# EAGLE design strobe_tuner (EAGLE 7.4.0)
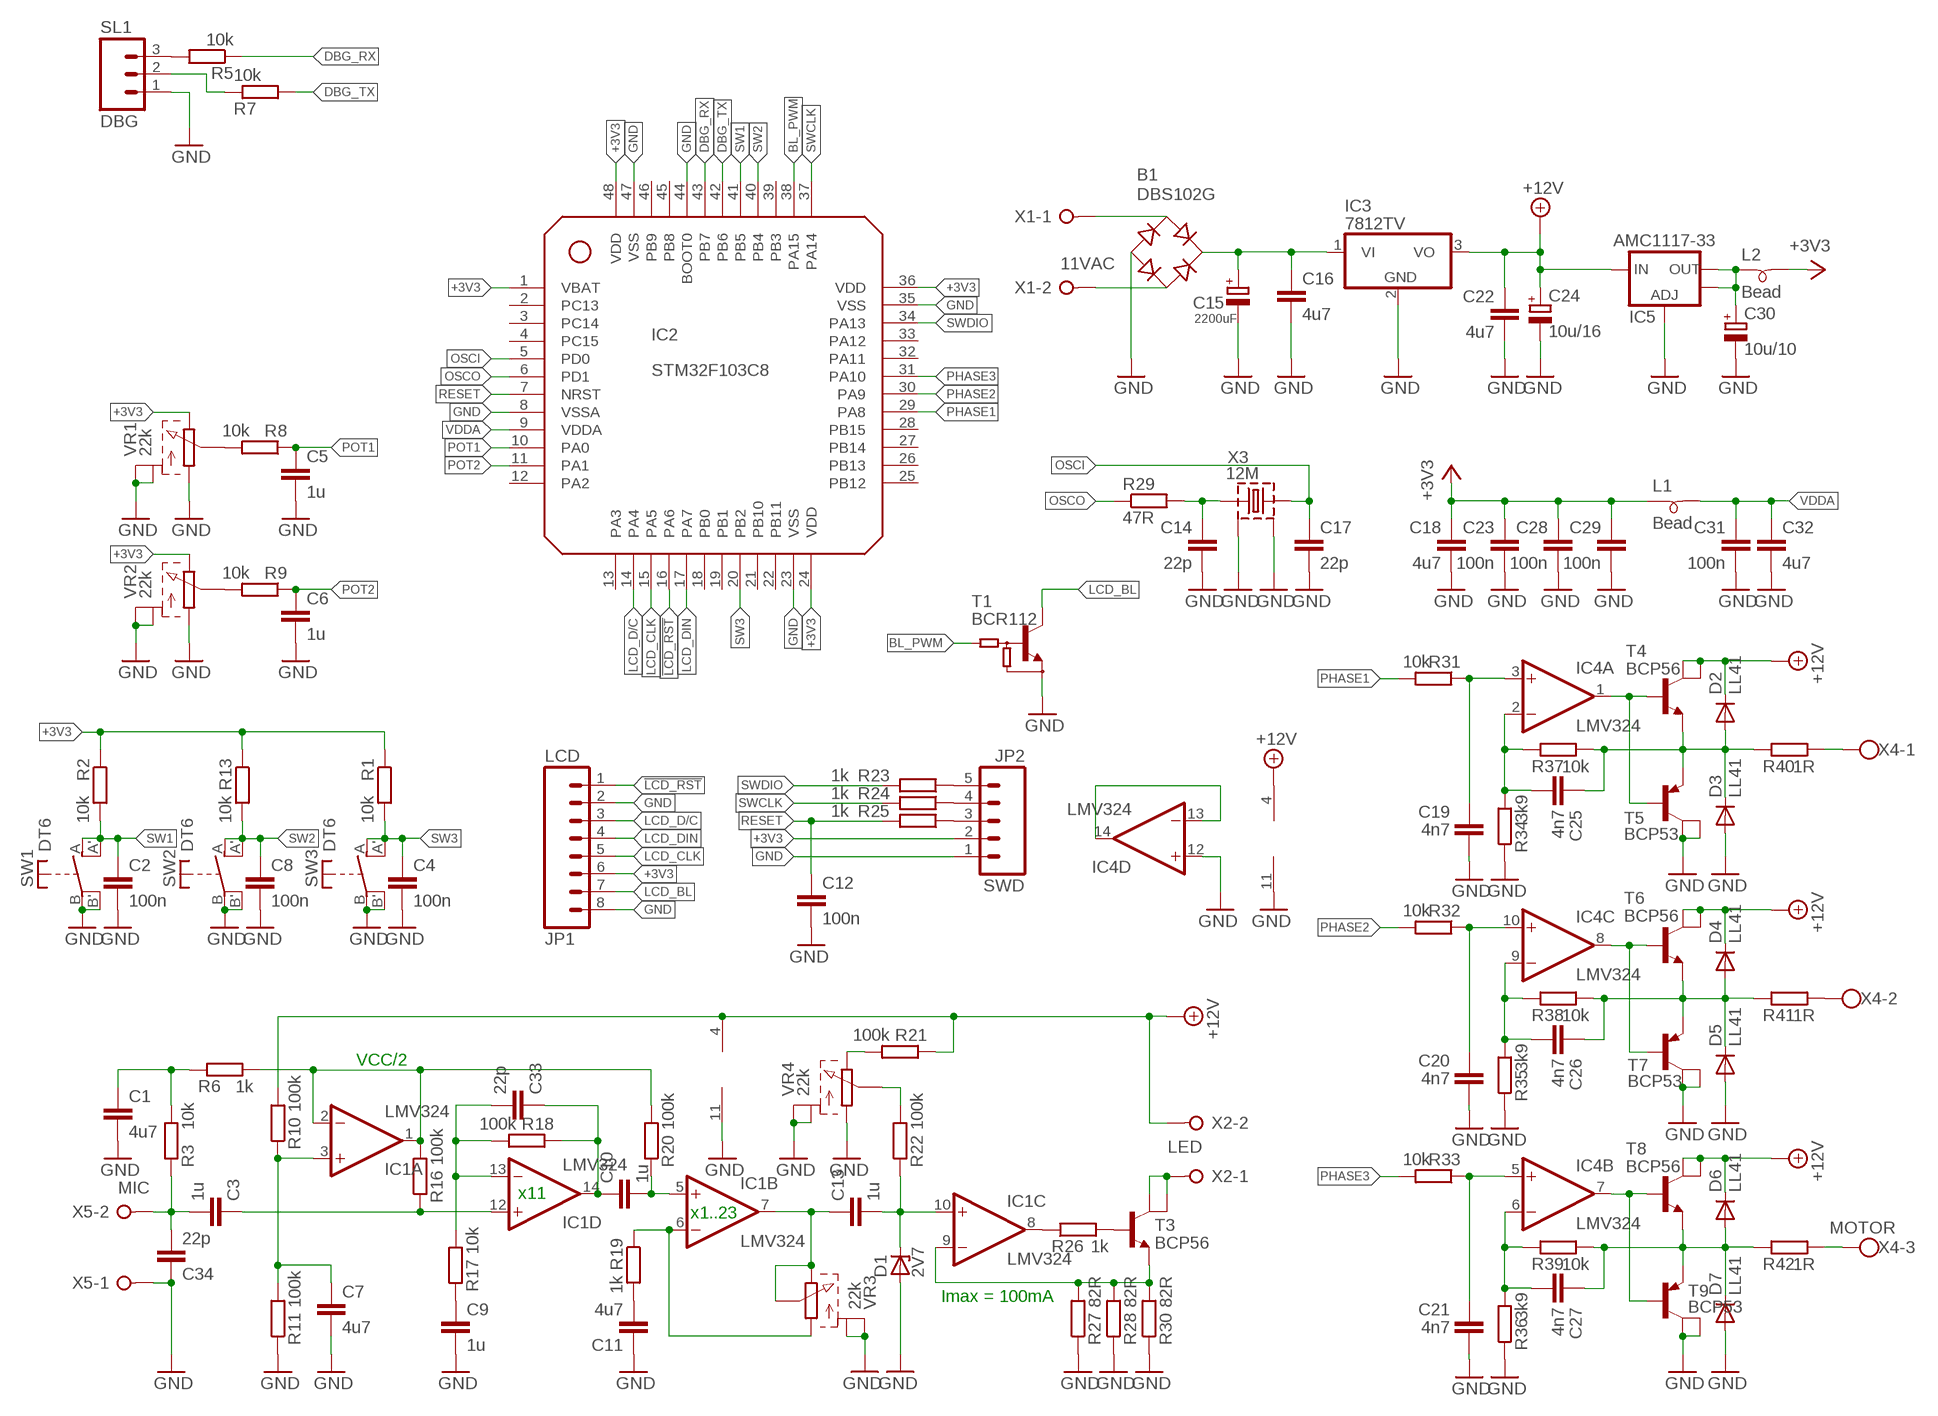
[diagram p0: schematic, sheet 1]

## Parts
B1  DBS102G  [DBS]
C1  4u7  1206_CAP  [1206]
C2  100n  0805_CAP  [0805]
C3  1u  1206_CAP  [1206]
C4  100n  0805_CAP  [0805]
C5  1u  1206_CAP  [1206]
C6  1u  1206_CAP  [1206]
C7  4u7  1206_CAP  [1206]
C8  100n  0805_CAP  [0805]
C9  1u  1206_CAP  [1206]
C10  1u  1206_CAP  [1206]
C11  4u7  1206_CAP  [1206]
C12  100n  0805_CAP  [0805]
C13  1u  1206_CAP  [1206]
C14  22p  0805_CAP  [0805]
C15  2200uF  CPOL-EUE5-13  [E5-13]
C16  4u7  1206_CAP  [1206]
C17  22p  0805_CAP  [0805]
C18  4u7  1206_CAP  [1206]
C19  4n7  0805_CAP  [0805]
C20  4n7  0805_CAP  [0805]
C21  4n7  0805_CAP  [0805]
C22  4u7  1206_CAP  [1206]
C23  100n  0805_CAP  [0805]
C24  10u/16  CPOL-EUB/3528-21W  [B/3528-21W]
C25  4n7  0805_CAP  [0805]
C26  4n7  0805_CAP  [0805]
C27  4n7  0805_CAP  [0805]
C28  100n  0805_CAP  [0805]
C29  100n  0805_CAP  [0805]
C30  10u/10  CPOL-EUA/3216-18R  [A/3216-18R]
C31  100n  0805_CAP  [0805]
C32  4u7  1206_CAP  [1206]
C33  22p  0805_CAP  [0805]
C34  22p  0805_CAP  [0805]
D1  2V7  ZENER-DIODESOT23  [SOT23]
D2  LL41  PMLL41SOD80C  [SOD80C]
D3  LL41  PMLL41SOD80C  [SOD80C]
D4  LL41  PMLL41SOD80C  [SOD80C]
D5  LL41  PMLL41SOD80C  [SOD80C]
D6  LL41  PMLL41SOD80C  [SOD80C]
D7  LL41  PMLL41SOD80C  [SOD80C]
IC1  LMV324  OPA4134UA  [SO14]
IC2  STM32F103C8  [LQFP48]
IC3  7812TV  [TO220V]
IC4  LMV324  OPA4134UA  [SO14]
IC5  AMC1117-33  V_REG_LM1117SOT223  [SOT223]
JP1  LCD  M08  [1X08]
JP2  SWD  M05LOCK_LONGPADS  [1X05_LOCK_LONGPADS]
L1  Bead  0805_IND  [0805]
L2  Bead  0805_IND  [0805]
R1  10k  0805_RES  [0805]
R2  10k  0805_RES  [0805]
R3  10k  0805_RES  [0805]
R5  10k  0805_RES  [0805]
R6  1k  0805_RES  [0805]
R7  10k  0805_RES  [0805]
R8  10k  0805_RES  [0805]
R9  10k  0805_RES  [0805]
R10  100k  0805_RES  [0805]
R11  100k  0805_RES  [0805]
R13  10k  0805_RES  [0805]
R16  100k  0805_RES  [0805]
R17  10k  0805_RES  [0805]
R18  100k  0805_RES  [0805]
R19  1k  0805_RES  [0805]
R20  100k  0805_RES  [0805]
R21  100k  0805_RES  [0805]
R22  100k  0805_RES  [0805]
R23  1k  0805_RES  [0805]
R24  1k  0805_RES  [0805]
R25  1k  0805_RES  [0805]
R26  1k  0805_RES  [0805]
R27  82R  0805_RES  [0805]
R28  82R  0805_RES  [0805]
R29  47R  0805_RES  [0805]
R30  82R  0805_RES  [0805]
R31  10k  0805_RES  [0805]
R32  10k  0805_RES  [0805]
R33  10k  0805_RES  [0805]
R34  3k9  0805_RES  [0805]
R35  3k9  0805_RES  [0805]
R36  3k9  0805_RES  [0805]
R37  10k  0805_RES  [0805]
R38  10k  0805_RES  [0805]
R39  10k  0805_RES  [0805]
R40  1R  0805_RES  [0805]
R41  1R  0805_RES  [0805]
R42  1R  0805_RES  [0805]
SL1  DBG  M03  [03P]
SW1  DT6  TACTSW_DT6  [D6R]
SW2  DT6  TACTSW_DT6  [D6R]
SW3  DT6  TACTSW_DT6  [D6R]
T1  BCR112  [SOT23]
T3  BCP56  [SOT223]
T4  BCP56  [SOT223]
T5  BCP53  [SOT223]
T6  BCP56  [SOT223]
T7  BCP53  [SOT223]
T8  BCP56  [SOT223]
T9  BCP53  [SOT223]
VR1  22k  R122KNP  [R122KNP]
VR2  22k  R122KNP  [R122KNP]
VR3  22k  R122KNP  [R122KNP]
VR4  22k  R122KNP  [R122KNP]
X1  11VAC  W237-02P  [W237-132]
X2  LED  W237-02P  [W237-132]
X3  12M  CPFX-104  [CPFX-104]
X4  MOTOR  W237-103  [W237-103]
X5  MIC  W237-02P  [W237-132]

## Nets
!LCD_RST: IC2.16(PA6) JP1.1
+3V3: C18.1 C23.1 C28.1 C29.1 IC2.1(VBAT) IC2.24(VDD) IC2.36(VDD) IC2.48(VDD) JP1.6 JP2.2 L1.2 L2.1 R1.1 R2.1 R13.1 VR1.CW(E) VR2.CW(E)
+12V: C22.1 C24.+ D2.C D4.C D6.C IC1.4(P:V+) IC3.3(VO) IC4.4(P:V+) IC5.3(IN) R10.2 R21.1 T4.2(C) T4.4(C1) T6.2(C) T6.4(C1) T8.2(C) T8.4(C1) X2.2
BL_PWM: IC2.38(PA15) T1.1(B)
DBG_RX: IC2.43(PB7) R5.1
DBG_TX: IC2.42(PB6) R7.2
GND: B1.- C1.2 C2.2 C4.2 C5.2 C6.2 C7.2 C8.2 C9.2 C11.1 C12.2 C14.2 C15.- C16.2 C17.2 C18.2 C19.2 C20.2 C21.2 C22.2 C23.2 C24.- C28.2 C29.2 C30.- C31.2 C32.2 C34.1 D1.1(A) D3.A D5.A D7.A IC1.11(P:V-) IC2.8(VSSA) IC2.23(VSS) IC2.35(VSS) IC2.44(BOOT0) IC2.47(VSS) IC3.2(GND) IC4.11(P:V-) IC4.12(D:+IN) IC5.1(ADJ) JP1.2 JP1.8 JP2.1 R11.1 R27.1 R28.1 R30.1 R34.1 R35.1 R36.1 SL1.1 SW1.B'(B2) SW1.B(B1) SW2.B'(B2) SW2.B(B1) SW3.B'(B2) SW3.B(B1) T1.2(E) T5.2(C) T5.4(C1) T7.2(C) T7.4(C1) T9.2(C) T9.4(C1) VR1.CCW(A) VR1.P$1(CASE1) VR1.P$2(CASE2) VR2.CCW(A) VR2.P$1(CASE1) VR2.P$2(CASE2) VR3.P$1(CASE1) VR3.P$2(CASE2) VR4.CCW(A) VR4.P$1(CASE1) VR4.P$2(CASE2) X3.2(G1) X3.4(G2) X5.1
LCD_BL: JP1.7 T1.3(C)
LCD_CLK: IC2.15(PA5) JP1.5
LCD_D/C: IC2.14(PA4) JP1.3
LCD_DIN: IC2.17(PA7) JP1.4
N$1: C19.1 IC4.3(A:+IN) R31.1
N$2: C20.1 IC4.10(C:+IN) R32.1
N$3: C21.1 IC4.5(B:+IN) R33.1
N$4: C27.1 D6.A D7.C R39.2 R42.1 T8.3(E) T9.3(E)
N$5: C1.1 R3.2 R6.1
N$6: C7.1 IC1.3(A:+IN) R10.1 R11.2
N$7: C3.2 C34.2 R3.1 X5.2
N$8: C11.2 R19.2
N$9: R26.2 T3.1(B)
N$10: C9.1 R17.1
N$11: IC4.1(A:OUT) T4.1(B) T5.1(B)
N$12: C25.2 IC4.2(A:-IN) R34.2 R37.1
N$13: C26.1 D4.A D5.C R38.2 R41.1 T6.3(E) T7.3(E)
N$14: IC4.8(C:OUT) T6.1(B) T7.1(B)
N$15: C26.2 IC4.9(C:-IN) R35.2 R38.1
N$16: C33.2 IC1.13(D:-IN) R17.2 R18.2
N$17: IC4.7(B:OUT) T8.1(B) T9.1(B)
N$18: C27.2 IC4.6(B:-IN) R36.2 R39.1
N$19: IC1.9(C:-IN) R27.2 R28.2 R30.2 T3.3(E)
N$20: T3.2(C) T3.4(C1) X2.1
N$21: IC1.8(C:OUT) R26.1
N$22: R40.2 X4.1
N$23: R41.2 X4.2
N$24: R42.2 X4.3
N$25: IC1.1(A:OUT) IC1.2(A:-IN) R6.2 R16.2 R20.2
N$26: C10.1 C33.1 IC1.14(D:OUT) R18.1
N$27: C3.1 IC1.12(D:+IN) R16.1
N$28: C13.2 D1.3(C) IC1.10(C:+IN) R22.1
N$29: IC1.6(B:-IN) R19.1 VR3.CCW(A)
N$30: C13.1 IC1.7(B:OUT) VR3.CW(E) VR3.SLIDER(S)
N$31: R21.2 VR4.CW(E)
N$32: R9.2 VR2.SLIDER(S)
N$33: C10.2 IC1.5(B:+IN) R20.1
N$35: R22.2 VR4.SLIDER(S)
N$39: R7.1 SL1.2
N$42: R8.2 VR1.SLIDER(S)
N$43: JP2.5 R23.1
N$44: C30.+ IC5.2(OUT) IC5.4(OUT) L2.2
N$45: C25.1 D2.A D3.C R37.2 R40.1 T4.3(E) T5.3(E)
N$46: B1.AC1 X1.1
N$47: B1.AC2 X1.2
N$48: IC4.13(D:-IN) IC4.14(D:OUT)
N$49: R5.2 SL1.3
N$53: JP2.4 R24.1
N$56: JP2.3 R25.1
N$90: C14.1 R29.2 X3.1
OSCI: C17.1 IC2.5(PD0) X3.3
OSCO: IC2.6(PD1) R29.1
PHASE1: IC2.29(PA8) R31.2
PHASE2: IC2.30(PA9) R32.2
PHASE3: IC2.31(PA10) R33.2
POT1: C5.1 IC2.10(PA0) R8.1
POT2: C6.1 IC2.11(PA1) R9.1
RESET: C12.1 IC2.7(NRST) R25.2
SW1: C2.1 IC2.41(PB5) R2.2 SW1.A'(A2) SW1.A(A1)
SW2: C8.1 IC2.40(PB4) R13.2 SW2.A'(A2) SW2.A(A1)
SW3: C4.1 IC2.20(PB2) R1.2 SW3.A'(A2) SW3.A(A1)
SWCLK: IC2.37(PA14) R24.2
SWDIO: IC2.34(PA13) R23.2
VDDA: C31.1 C32.1 IC2.9(VDDA) L1.1
VIN: B1.+ C15.+ C16.1 IC3.1(VI)
Unconnected: IC2.2(PC13) IC2.3(PC14) IC2.4(PC15) IC2.12(PA2) IC2.13(PA3) IC2.18(PB0) IC2.19(PB1) IC2.21(PB10) IC2.22(PB11) IC2.25(PB12) IC2.26(PB13) IC2.27(PB14) IC2.28(PB15) IC2.32(PA11) IC2.33(PA12) IC2.39(PB3) IC2.45(PB8) IC2.46(PB9)

## Notes on the sheet
- VCC/2
- x11
- x1..23
- Imax = 100mA

## Library data of the parts
B1 = rectifier:DB?*G: Single Phase 1.0 AMP Glass Passivated Bridge Rectifier Taiwan Semiconductor Co.,Ltd. - TSC Source: http://www.taiwansemi.com/TSCbig5/ezcatfiles/cust/img/img/db101g.pdf http://www.ts.com.tw/db/pictures/modules/PDT/PDT060207001/DBLS201G.pdf
C1 C3 C5-C7 C9-C11 C13 C16 C18 C22 C32 = _michalkob:1206_CAP
C2 C4 C8 C12 C14 C17 C19-C21 C23 C25-C29 C31 C33 C34 = _michalkob:0805_CAP
C15 C24 C30 = rcl:CPOL-EU: POLARIZED CAPACITOR, European symbol
D1 = diode:ZENER-DIODE: Z-Diode
D2-D7 = diode:PMLL41*: High-speed diodes Source: http://www.semiconductors.philips.com/acrobat_download/datasheets/PMLL4150_2.pdf
IC1 IC4 = linear:OPA4*: Quad Operational Amplifier compatible with: TLC27L4 Low Power, Single-Supply, Rail-To-Rail Operational Amplifier Source: http://focus.ti.com/lit/ds/symlink/opa2345.pdf http://focus.ti.com .. opa241.pdf http://focus.ti.com .. tlc27l4.pdf http://focus.ti.com/lit/ds/symlink/opa2134.pdf
IC2 = _michalkob:STM32F103C8
IC3 = linear:78*: Positive VOLTAGE REGULATOR Source: http://cache.national.com/ds/LM/LM78L05.pdf http://www.fairchildsemi.com/ds/LM/LM7805.pdf
IC5 = SparkFun:V_REG_LM1117: Voltage Regulator LM1117 Standard adjustable voltage regulator but in SMD form. Spark Fun Electronics SKU : COM-00595
JP1 = SparkFun:M08: Header 8 Standard 8-pin 0.1" header. Use with straight break away headers (SKU : PRT-00116), right angle break away headers (PRT-00553), swiss pins (PRT-00743), machine pins (PRT-00117), and female headers (PRT-00115).
JP2 = SparkFun:M05: Header 5 Standard 5-pin 0.1" header. Use with straight break away headers (SKU : PRT-00116), right angle break away headers (PRT-00553), swiss pins (PRT-00743), machine pins (PRT-00117), and female headers (PRT-00115). Molex polarized connector foot print use with SKU : PRT-08230 with associated crimp pins and housings.
L1 L2 = _michalkob:0805_IND
R1-R3 R5-R11 R13 R16-R42 = _michalkob:0805_RES
SL1 = con-amp-quick:M03: AMP QUICK CONNECTOR; OC_FARNELL: unknown; OC_NEWARK: unknown
SW1-SW3 = _michalkob:TACTSW_DT6
T1 = _michalkob:BCR112
T3 T4 T6 T8 = _michalkob:BCP56
T5 T7 T9 = _michalkob:BCP53
VR1-VR4 = _michalkob:R122KNP
X1 X2 X5 = con-wago-508:W237-02P: WAGO SREW CLAMP; OC_FARNELL: unknown; OC_NEWARK: unknown
X3 = _michalkob:CPFX-104
X4 = con-wago-500:W237-103: WAGO SCREW CLAMP; MPN: 237-103; OC_FARNELL: unknown; OC_NEWARK: 18M7116

## Board
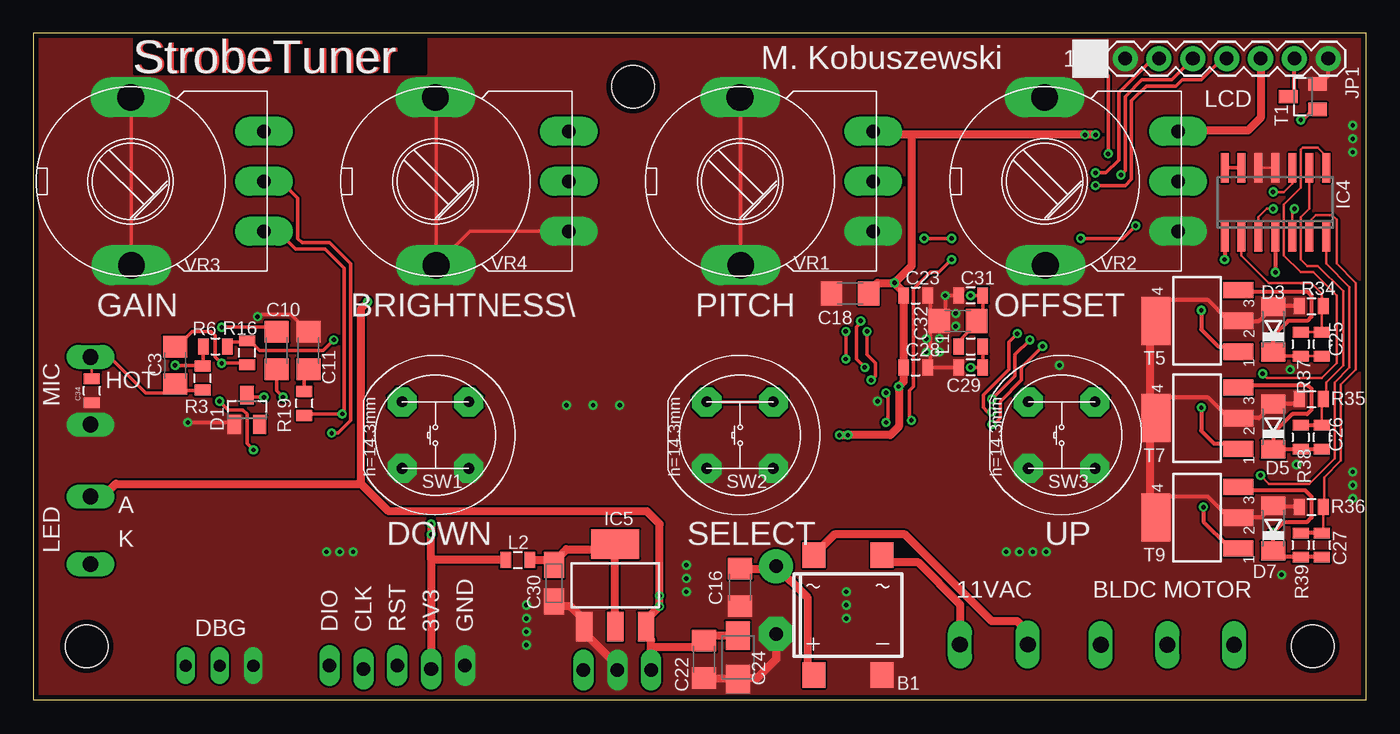
[diagram p1: board, top side]
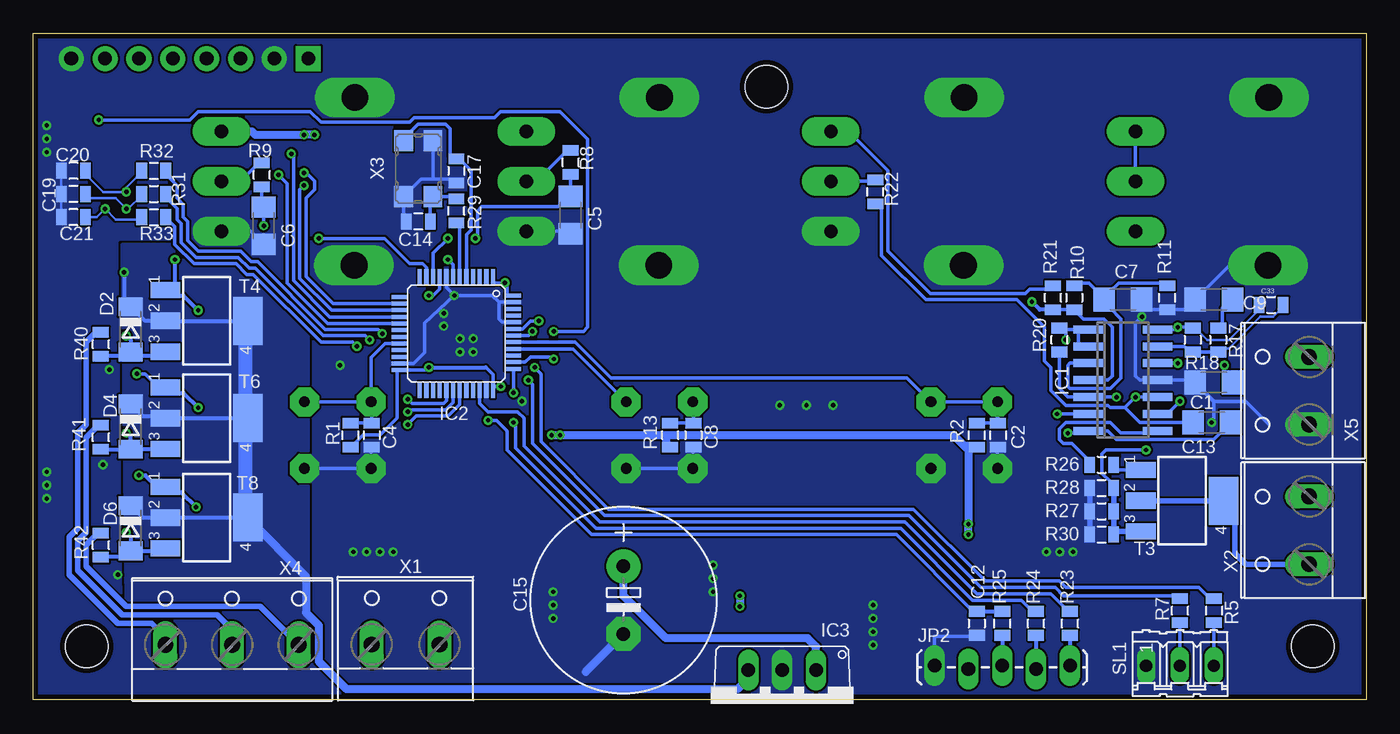
[diagram p2: board, bottom side, seen from below]

Size 100 x 50 mm. Coordinates in mm from the lower left corner, seen from the top.
Outline: 0,0 100,0 100,50 0,50 0,0
Copper layers (1*16): Top 0.0356mm / dielectric 1.5011mm / Bottom 0.0356mm
Design rules "LaenPCBOrder": minimum track width 6mil, minimum drill 13mil, track to track 6mil, track to pad 6mil, pad to pad 6mil, via to via 6mil, smd to smd 6mil, copper to edge 15mil, drill to drill 6mil, minimum pad ring 7mil, minimum via ring 7mil, stop-mask expansion 3mil, vias tented up to drill 0mil, thermal gap 10mil
Holes 3.2 mm at 4,4 96,4 45,46

### Footprints (pad centres in the part's own frame; a part is rotated, then mirrored left to right if it is on the bottom)
DBS = smd 1.7 x 1.9: + -2.55,-4.5; - 2.55,-4.5; AC1 -2.55,4.5; AC2 2.55,4.5
1206 = smd 1.6 x 1.8: 1 -1.4,0; 2 1.4,0
0805 = smd 0.8 x 1.2: 1 -0.9,0; 2 0.9,0
E5-13 = drill 1.016 pad 2.54: + -2.54,0 | drill 1.016 pad 2.54 octagon: - 2.54,0
B/3528-21W = smd 2.15 x 1.8: + 1.625,0; - -1.625,0
A/3216-18R = smd 1.95 x 1.5: + 1.375,0; - -1.375,0
SOT23 = smd 1 x 1.4: 1 -0.95,-1.1; 2 0.95,-1.1; 3 0,1.1
SOD80C = smd 1.4 x 1.8: A 1.7,0; C -1.7,0
SO14 = smd 0.6 x 2.2: 1 -3.81,-2.6; 2 -2.54,-2.6; 3 -1.27,-2.6; 4 0,-2.6; 5 1.27,-2.6; 6 2.54,-2.6; 7 3.81,-2.6; 8 3.81,2.6; 9 2.54,2.6; 10 1.27,2.6; 11 0,2.6; 12 -1.27,2.6; 13 -2.54,2.6; 14 -3.81,2.6
LQFP48 = smd 0.3 x 1.2: 1 -2.75,-4.25; 2 -2.25,-4.25; 3 -1.75,-4.25; 4 -1.25,-4.25; 5 -0.75,-4.25; 6 -0.25,-4.25; 7 0.25,-4.25; 8 0.75,-4.25; 9 1.25,-4.25; 10 1.75,-4.25; 11 2.25,-4.25; 12 2.75,-4.25; 25 2.75,4.25; 26 2.25,4.25; 27 1.75,4.25; 28 1.25,4.25; 29 0.75,4.25; 30 0.25,4.25; 31 -0.25,4.25; 32 -0.75,4.25; 33 -1.25,4.25; 34 -1.75,4.25; 35 -2.25,4.25; 36 -2.75,4.25 | smd 1.2 x 0.3: 13 4.25,-2.75; 14 4.25,-2.25; 15 4.25,-1.75; 16 4.25,-1.25; 17 4.25,-0.75; 18 4.25,-0.25; 19 4.25,0.25; 20 4.25,0.75; 21 4.25,1.25; 22 4.25,1.75; 23 4.25,2.25; 24 4.25,2.75; 37 -4.25,2.65; 38 -4.25,2.15; 39 -4.25,1.65; 40 -4.25,1.15; 41 -4.25,0.65; 42 -4.25,0.15; 43 -4.25,-0.35; 44 -4.25,-0.85; 45 -4.25,-1.35; 46 -4.25,-1.85; 47 -4.25,-2.35; 48 -4.25,-2.85
TO220V = drill 1.016 long: 1 -2.54,-2.54; 2 0,-2.54; 3 2.54,-2.54
SOT223 = smd 1.219 x 2.235: 1 -2.311,-3.099; 2 0,-3.099; 3 2.311,-3.099 | smd 3.6 x 2.2: 4 0,3.099
1X08 = drill 1.016 pad 1.88 square: 1 0,0 | drill 1.016 pad 1.88: 2 2.54,0; 3 5.08,0; 4 7.62,0; 5 10.16,0; 6 12.7,0; 7 15.24,0; 8 17.78,0
1X05_LOCK_LONGPADS = drill 1.016 long: 1 0,0; 2 2.54,-0.254; 3 5.08,0; 4 7.62,-0.254; 5 10.16,0
03P = drill 0.914 long: 1 -2.54,0; 2 0,0; 3 2.54,0
D6R = drill 0.8 pad 2.184 octagon: A -2.5,2.5; A' 2.5,2.5; B -2.5,-2.5; B' 2.5,-2.5
R122KNP = drill 1 pad 2.184 long: CCW -3.75,-10; CW 3.75,-10; SLIDER 0,-10 | drill 2 pad 3 long: P$1 -6.3,-0.05; P$2 6.3,0
W237-132 = drill 1.194 long: 1 -2.54,-0.635; 2 2.54,-0.635
CPFX-104 = smd 1.6 x 1.4: 1 -2.1,-1.1; 2 2.1,-1.1; 3 2.1,1.1; 4 -2.1,1.1
W237-103 = drill 1.194 long: 1 -5,-1.29; 2 0,-1.29; 3 5,-1.29

### Placement (x,y rotation side)
B1  61.12,6.35 0 top
C1  11.43,23.81 180 bottom
C2  27.62,19.84 270 bottom
C3  10.64,25.08 270 top
C4  74.61,19.84 270 bottom
C5  59.69,36.35 270 bottom
C6  82.71,35.56 270 bottom
C7  18.26,30 0 bottom
C8  50.48,19.84 270 bottom
C9  11.43,30 180 bottom
C10  18.26,26.19 270 top
C11  20.64,26.19 270 top
C12  29.21,5.71 270 bottom
C13  11.59,20.8 180 bottom
C14  71.12,35.88 180 bottom
C15  55.72,7.46 270 bottom
C16  53.02,8.41 270 top
C17  68.26,39.69 270 bottom
C18  61.28,30.48 180 top
C19  97,37.94 180 bottom
C20  97,39.69 180 bottom
C21  97,36.2 180 bottom
C22  50.32,3.02 270 top
C23  66.2,30.32 0 top
C24  52.86,3.17 90 top
C25  96.68,26.67 90 top
C26  96.68,19.68 90 top
C27  96.68,11.59 90 top
C28  66.2,24.92 0 top
C29  70.33,24.92 180 top
C30  39.05,8.73 90 top
C31  70.33,30.32 180 top
C32  69.37,28.42 180 top
C33  7.13,29.62 0 bottom
C34  4.38,23.18 90 top
D1  16.03,21.75 0 top
D2  92.71,27.78 270 bottom
D3  93.03,27.78 90 top
D4  92.71,20.48 270 bottom
D5  93.03,20.48 90 top
D6  92.71,12.86 270 bottom
D7  93.03,12.86 90 top
IC1  18.26,23.97 270 bottom
IC2  68.26,27.46 180 bottom
IC3  43.81,-0.32 180 bottom
IC4  93.19,37.31 0 top
IC5  43.66,8.57 0 top
JP1  79.38,48.1 0 top
JP2  32.38,2.54 0 bottom
L1  70.33,26.51 0 top
L2  36.35,10.48 0 top
R1  76.2,19.84 90 bottom
R2  29.21,19.84 90 bottom
R3  12.7,24.13 90 top
R5  11.43,6.67 270 bottom
R6  13.65,26.51 0 top
R7  13.97,6.67 90 bottom
R8  59.69,40.32 90 bottom
R9  82.87,39.37 90 bottom
R10  21.91,30.16 270 bottom
R11  14.92,30.16 90 bottom
R13  52.23,19.84 90 bottom
R16  16.03,26.04 90 top
R17  11.11,26.99 270 bottom
R18  13.02,26.99 270 bottom
R19  20.32,22.23 90 top
R20  23.02,26.99 90 bottom
R21  23.5,30.16 90 bottom
R22  36.83,38.1 90 bottom
R23  22.23,5.71 90 bottom
R24  24.77,5.71 90 bottom
R25  27.3,5.71 90 bottom
R26  19.84,17.62 0 bottom
R27  19.84,14.13 0 bottom
R28  19.84,15.88 0 bottom
R29  68.26,36.67 90 bottom
R30  19.84,12.38 0 bottom
R31  90.96,37.94 0 bottom
R32  90.96,39.69 0 bottom
R33  90.96,36.2 0 bottom
R34  95.89,29.53 0 top
R35  95.89,22.54 0 top
R36  95.89,14.45 0 top
R37  95.09,26.67 270 top
R38  95.09,19.68 270 top
R39  95.09,11.59 270 top
R40  94.93,26.67 90 bottom
R41  94.93,19.68 90 bottom
R42  94.93,11.59 90 bottom
SL1  13.97,2.54 0 bottom
SW1  30.16,19.84 0 top
SW2  53.02,19.84 0 top
SW3  77.15,19.84 0 top
T1  95.25,45.24 90 top
T3  13.81,14.92 270 bottom
T4  87,28.42 270 bottom
T5  87.31,28.42 90 top
T6  87,21.11 270 bottom
T7  87.31,21.11 90 top
T8  87,13.65 270 bottom
T9  87.31,13.65 90 top
VR1  53.02,38.89 90 top
VR2  75.88,38.89 90 top
VR3  7.3,38.89 90 top
VR4  30.16,38.89 90 top
X1  72.07,4.76 0 bottom
X2  4.92,12.7 90 bottom
X3  71.12,39.85 90 bottom
X4  85.09,5.4 0 bottom
X5  4.92,23.18 90 bottom

### Tracks (layer width: path | path; a pad name or v marks a point on that pad's centre or on a via)
!LCD_RST  (via drill 0.33)
  Top 0.254: v80.64,40.96 80.64,46.83 JP1.1
  Bottom 0.254: IC2.16 77.77,28.71 80.49,31.43 80.49,40.8 v80.64,40.96
+3V3  (via drill 0.33)
  Top 0.254: L1.2 C29.1 v70.33,24.92 | 65.09,30.8 65.09,30.64 65.3,30.43 C23.1 65.56,30.06 | C18.1 62.68,31.11
  Top 0.305: 65.3,30.53 C23.1
  Top 0.61: L2.1 29.84,10.48 | 29.84,10.48 JP2.2 | 29.84,10.48 v29.84,12.38 v29.84,13.18 | JP1.6 92.08,43.66 91.12,42.7 85.94,42.7 VR2.CW | v78.9,42.39 v79.69,42.39 65.88,42.39 | 65.88,42.39 63.28,42.39 VR1.CW | 65.88,42.39 65.88,32.54 v64.61,31.27 | v64.61,31.27 65.3,30.59 C23.1 C28.1 65.3,23.86 v64.93,23.5 64.93,20.48 64.29,19.84 v61.12,19.84 v60.48,19.84 | C18.1 62.68,30.61 63.34,31.27 v64.61,31.27
  Bottom 0.254: 64,30.32 IC2.48 | 64.02,30.32 IC2.48 | v70.33,24.92 70.54,24.71 IC2.24 72.76,24.71 72.71,24.61 72.71,21.11 73.98,19.84 75.25,19.84 75.88,19.21 75.94,19.21 R1.1 | 66.04,24.92 65.51,24.4 IC2.36 65.51,23.5 v64.93,23.5 | IC2.1 65.51,31.27 v64.61,31.27 64.45,31.11 64.45,30.31 IC2.48 | R2.1 29.48,19.21 30.16,19.21 | 52.49,19.21 R13.1
  Bottom 0.305: v70.33,24.92 66.04,24.92
  Bottom 0.61: v29.84,12.38 v29.84,13.18 29.84,18.73 | R2.1 29.84,18.94 29.84,18.73 | VR2.CW 83.6,42.64 83.34,42.39 v79.69,42.39 v78.9,42.39 | v60.48,19.84 v61.12,19.84 52.55,19.84 | 52.55,19.84 30.96,19.84 29.84,18.73 | 52.49,19.21 52.49,19.79 52.55,19.84
+12V  (via drill 0.33)
  Top 0.305: IC4.4 v93.19,32.07
  Top 0.61: IC3.3 46.35,3.97 | 46.35,3.97 49.69,3.97 50.14,4.42 C22.1 50.71,4.8 C24.+ 53.34,5.28 53.34,5.56 | 46.35,3.97 46.35,4.45 45.88,4.92 45.88,5.38 IC5.3 46.2,5.7 46.2,6.19 v46.99,6.99 v46.99,7.78 46.99,13.18 46.04,14.13 26.67,14.13 24.61,16.19 | 24.61,16.19 24.61,29.37 v25.08,29.84 | X2.2 5.24,15.24 6.19,16.19 24.61,16.19
  Bottom 0.254: IC1.4 19.37,23.97 19.05,24.29 19.05,27.94 19.68,28.57 21.22,28.57 R10.2 R21.1
  Bottom 0.305: 84.77,26.83 84.45,27.15 84.45,27.86 T4.4 | D4.C 91.8,21.27 90.49,21.27 90.33,21.11 T6.2 T6.4 | D6.C 91.8,13.65 T8.2 T8.4 T6.4 | T4.4 84.3,28.42 T4.2 91.6,28.42 92.23,29.05 92.28,29.05 D2.C 93.19,29.96 v93.19,32.07 | T6.4 T4.4 | R21.1 24.5,29.26 v25.08,29.84
  Bottom 0.61: T4.4 83.9,13.58 | 83.9,13.58 84.3,13.18 | 84.3,13.18 84.3,28.42 83.66,28.42 83.19,28.89 | v46.99,7.78 v46.99,6.99 | 84.45,12.38 84.45,13.02 84.3,13.18 | 83.9,13.58 79.53,9.21 79.53,6.51 78.58,5.56 78.58,2.86 76.52,0.79 47.15,0.79 46.35,1.59 IC3.3
  pour Bottom (no thermals): 79.38,27.78 83.5,31.91 83.98,31.91 84.77,32.7 87.95,32.7 89.38,34.13 93.34,34.13 93.03,6.99 82.87,6.99 79.38,3.49
BL_PWM  (via drill 0.33)
  Top 0.254: T1.1 96.05,44.29 95.25,43.5 v95.09,43.5 | v60.96,27.62 v60.96,25.56
  Bottom 0.254: IC2.38 63.11,25.31 62.71,25.72 61.12,25.72 v60.96,25.56 | v95.09,43.5 88.27,43.5 87.63,44.13 79.22,44.13 78.42,43.34 71.75,43.34 71.44,43.66 65.41,43.66 64.93,44.13 60.48,44.13 58.42,42.07 58.42,27.94 58.74,27.62 v60.96,27.62
DBG_RX  (via drill 0.33)
  Top 0.254: v62.39,24.92 61.75,25.56 61.75,27.94 62.07,28.26 v62.07,28.42
  Bottom 0.254: R5.1 11.64,7.78 11.91,7.78 12.54,8.41 22.54,8.41 23.02,8.89 28.57,8.89 33.97,14.29 56.83,14.29 61.91,19.37 61.91,24.45 v62.39,24.92 | IC2.43 63.31,27.81 62.71,28.42 v62.07,28.42
DBG_TX  (via drill 0.33)
  Top 0.254: v62.87,23.97 63.18,24.29 63.18,25.24 62.55,25.88 v62.55,27.62
  Bottom 0.254: R7.2 14.18,7.78 22.7,7.78 23.34,8.41 28.89,8.41 34.29,13.81 57.15,13.81 62.55,19.21 62.55,23.65 v62.87,23.97 | v62.55,27.62 62.86,27.31 IC2.42
GND  (via drill 0.33)
  Top 0.203: IC4.12 IC4.11
  Top 0.254: C11.1 19.34,28.89 16.99,28.89 v16.83,28.73 | D1.1 15.08,20.64 14.92,20.8 v11.59,20.8 | VR4.CCW 32.76,35.14 VR4.P$1 30.21,45.14 VR4.P$2 | VR3.P$2 7.35,45.14 VR3.P$1 | VR1.P$2 53.07,45.14 VR1.P$1 | T1.2 96.52,46.19 96.84,46.51 | C31.2 v68.42,30.32 68.42,29.21 67.97,28.6 C32.2 | C32.2 67.34,27.78 67.31,27.78 67.31,24.92 C28.2 C29.2 69.53,24.82 | C23.2 67.31,30.11 67.31,28.73 67.63,28.42 C32.2
  Top 0.305: R34.1 93.03,29.53 D3.A 91.96,28.42 T5.2 90.25,28.57 89.53,28.57 88.11,30 85.09,30 | R35.1 94.78,22.18 D5.A 91.96,21.11 T7.2 90.09,21.43 89.38,21.43 88.11,22.7 85.09,22.7 | R36.1 93.14,14.45 D7.A 92.12,13.65 T9.2 90.09,13.97 89.38,13.97 88.11,15.24 84.45,15.24 | 85.09,30 84.21,29.13 T5.4 84.45,28.18 83.82,27.54 83.82,27.15 | T7.4 84.21,21.82 85.09,22.7 | T9.4 84.21,15 84.45,15.24 | T7.4 84.45,20.87 84.45,19.68 85.09,20.32 85.09,22.7 | 84.45,15.24 84.3,15.24 83.82,14.76 83.82,14.92 | T7.4 83.82,20.72 83.82,27.15 | 85.09,30 84.14,30 83.82,29.69 | 83.66,26.99 83.82,27.15 | 96.84,46.51 97.16,46.83 JP1.8
  Top 0.61: IC3.2 43.81,2.54 41.34,5.01 IC5.1 41.27,5.54 41.27,6.03 40.32,6.99 39.42,6.99 C30.- | C24.- 50.39,1.55 C22.2 | C24.- 53.14,1.55 | 83.82,14.92 83.82,27.15 83.82,29.69 | 56.38,5.58 C15.- 55.72,3.02 54.29,1.59 52.9,1.59 C24.-
  Bottom 0.203: C21.2 C19.2 C20.2
  Bottom 0.254: 16.93,29.26 R11.1 12.99,29.26 C9.2 | C1.2 12.99,23.97 IC1.11 16.99,23.97 17.3,24.29 17.3,28.26 v16.83,28.73 16.83,29.37 16.93,29.26 | 12.83,30.03 C9.2 | 17.3,30 17.3,29.56 arc90 C7.2 17.02,29.26 16.93,29.26 | v11.59,20.8 11.43,20.95 11.43,22.38 9.05,22.38 7.3,20.64 | VR2.P$2 75.93,45.14 | C14.2 72.22,36.08 X3.4 70.91,39.05 70.01,39.05 | 70.01,39.05 68.53,39.05 arc90 C17.2 | X3.2 70.02,39.06 arc-90 70.01,39.05 | C5.2 59.88,35.14 VR1.CCW | C6.2 83.69,35.14 VR2.CCW | C2.2 27.66,18.9 SW1.B | C8.2 50.52,18.9 SW2.B SW2.B' | C4.2 74.65,18.9 SW3.B SW3.B' | IC2.8 69.01,30.91 v68.42,30.32 | 32.38,3.65 32.38,4.76 29.26,4.76 C12.2 | IC2.23 71.47,25.21 70.64,26.04 70.64,28.26 v68.42,30.32 | IC2.47 65.06,29.81 | 65.06,29.81 65.56,30.32 v68.42,30.32 | IC2.44 64.83,28.31 65.06,28.54 65.06,29.81 | VR3.P$1 10.24,32.59 12.22,30.61 | 12.22,30.64 12.22,30.61 | 12.22,30.61 C9.2
  Bottom 0.305: 11.43,22.38 12.83,23.78 C1.2 | 32.38,3.65 JP2.1
  Bottom 0.406: R30.1 R27.1 R28.1 20.74,15.93 | 30.16,32.54 VR4.P$1
  Bottom 0.61: 58.57,2.07 C15.-
  other vias: 94.77,17.62 94.3,24.77 93.66,9.37 76.99,25.08 63.34,22.38 75.99,11.08 74.99,11.08 73.99,11.08 72.99,11.08 60.99,8.08 60.99,7.08 60.99,6.08 48.99,8.08 48.99,9.08 48.99,10.08 36.99,4.08 36.99,5.08 36.99,6.08 36.99,7.08 23.99,11.08 21.99,11.08 22.99,11.08 43.99,22.08 41.99,22.08 39.99,22.08 66.99,27.08 66.99,26.08 67.99,26.08 67.99,27.08 98.99,43.08 98.99,42.08 98.99,41.08 98.99,17.08 98.99,16.08 98.99,15.08 69.21,28.02 69.21,28.98
  pour Bottom (rank 2, no thermals): 0,0 0,50.01 100.01,50.01 100.01,0
  pour Top (rank 2, no thermals): 0,0 0,50.01 100.01,50.01 100.01,0
LCD_BL
  Top 0.254: 94.3,45.39 T1.3
  Top 0.305: 94.3,45.39 94.61,45.71 JP1.7
LCD_CLK  (via drill 0.33)
  Top 0.254: v79.69,38.58 81.92,38.58 82.39,39.05 82.39,44.93 83.5,46.04 85.72,46.04 86.2,46.51 87.63,46.51 89.22,48.1 JP1.5
  Bottom 0.254: IC2.15 77.63,29.21 80.01,31.59 80.01,38.26 v79.69,38.58
LCD_D/C  (via drill 0.33)
  Top 0.254: v79.69,39.53 80.49,39.53 81.44,40.48 81.44,45.56 83.98,48.1 JP1.3
  Bottom 0.254: IC2.14 77.5,29.71 79.53,31.75 79.53,37.62 78.9,38.26 78.9,38.89 79.53,39.53 v79.69,39.53
LCD_DIN  (via drill 0.33)
  Top 0.254: v81.6,39.37 81.92,39.69 81.92,45.24 83.19,46.51 85.41,46.51 JP1.4
  Bottom 0.254: IC2.17 77.9,28.21 80.96,31.27 80.96,38.73 v81.6,39.37
N$1  (via drill 0.33)
  Top 0.203: v93.03,36.83 92.55,36.83 91.92,36.2 IC4.3
  Bottom 0.203: C19.1 96.1,37.84 95.89,37.62 93.82,37.62 v93.03,36.83 92.87,36.83 91.86,37.84 R31.1
N$2  (via drill 0.33)
  Top 0.203: v93.03,38.1 93.82,38.1 94.46,38.73 IC4.10
  Bottom 0.203: C20.1 96.1,39.42 94.77,38.1 v93.03,38.1 93.03,38.42 92.23,39.21 92.08,39.21 92.08,39.48 R32.1
N$3  (via drill 0.33)
  Top 0.203: v94.61,36.83 94.46,36.67 IC4.5
  Bottom 0.203: C21.1 95.25,36.2 v94.61,36.83 93.82,36.04 92.08,36.04 91.92,36.2 R33.1
N$4  (via drill 0.33)
  Top 0.305: C27.1 R39.2 93.5,10.69 D7.C | D7.C 93.34,10.85 93.77,10.85 | D7.C v93.03,12.54 93.82,13.34 95.57,13.34 95.89,13.65 95.89,15.24 95.41,15.72 90.66,15.72 T9.3
  Bottom 0.305: v93.03,12.54 92.71,12.22 D6.A | D6.A 90.28,11.16 T8.3 | D6.A D7.C 93.5,10.69 R42.1
N$5  (via drill 0.33)
  Top 0.254: R6.1 12.75,25.08 R3.2 12.44,25.03 12.38,25.08 v10.64,25.08
  Bottom 0.254: v10.64,25.08 10.64,24.42 C1.1
N$6
  Bottom 0.254: R11.2 14.97,31.27 18.57,31.27 19.21,30.64 19.21,30.45 C7.1 | R10.1 arc90 21.7,31.27 20.8,31.27 20,30.48 20,30.35 C7.1 | IC1.3 22.23,25.24 22.38,25.08 22.38,23.5 22.23,23.34 19.21,23.34 18.41,24.13 18.41,28.57 19.21,29.37 19.21,29.56 C7.1
N$7
  Top 0.203: C34.2 4.38,25.62 X5.2
  Top 0.254: R3.1 12.65,23.18 11.27,23.18 10.77,23.68 C3.2 10.64,23.65 10,23.02 8.41,23.02 5.71,25.72 X5.2
N$8
  Top 0.254: R19.2 20.32,24.48 C11.2
N$9
  Bottom 0.254: R26.2 18.73,17.41 18.73,17.3 18.66,17.23 T3.1
N$10
  Bottom 0.254: C9.1 10.19,29.37 10.79,29.37 10.79,27.89 R17.1
N$11  (via drill 0.33)
  Top 0.305: 89.53,26.35 90.16,26.35 T5.1 90,26.51 88.9,26.51 87.63,27.78 v87.63,29.21 | IC4.1 v89.38,33.02
  Bottom 0.305: T4.1 89.62,30.73 89.53,30.64 | 89.53,30.64 89.22,30.32 88.74,30.32 v87.63,29.21 | v89.38,33.02 89.38,30.64 89.53,30.64
N$12
  Top 0.203: 96.68,29.37 C25.2 R37.1 | IC4.2 90.65,33.34 92.71,31.27 95.89,31.27 96.68,30.48 96.68,29.63
  Top 0.305: 96.68,29.37 R34.2 96.68,29.63
N$13  (via drill 0.33)
  Top 0.305: C26.1 R38.2 D5.C v93.03,20 94.46,21.43 95.57,21.43 95.89,21.75 95.89,23.34 95.64,23.58 90.57,23.58 T7.3
  Bottom 0.305: T6.3 90.12,18.78 D4.A | R41.1 D4.A | D4.A 92.71,19.68 v93.03,20
N$14  (via drill 0.33)
  Top 0.203: IC4.8 97,40.8 96.36,41.43 95.25,41.43 95.09,41.27 95.09,38.42 93.82,37.15 93.82,33.34 95.09,32.07 96.04,32.07 97.79,30.32 97.79,25.24 96.68,24.13 92.55,24.13 v92.23,24.45
  Top 0.305: v87.63,21.91 87.63,20.16 88.58,19.21 90,19.21 T7.1
  Bottom 0.254: v92.23,24.45 91.6,24.45 90.96,23.81 90.48,23.81 T6.1
  Bottom 0.305: T6.1 89.62,23.43 89.22,23.02 88.74,23.02 v87.63,21.91
N$15
  Top 0.203: 96.68,22.28 C26.2 | IC4.9 95.73,36.83 95.09,36.2 95.09,33.02 95.57,32.54 96.36,32.54 98.27,30.64 98.27,25.08 97,23.81 97,22.75 R35.2
  Top 0.305: R35.2 96.68,22.28 | C26.2 R38.1
N$16
  Bottom 0.203: R17.2 10.9,26.09 10.64,26.35 10.32,26.35 7.94,28.73 6.99,28.73 6.51,29.21 6.51,29.34 C33.2
  Bottom 0.254: IC1.13 13.65,26.51 13.49,26.35 13.28,26.35 R18.2 R17.2
N$17  (via drill 0.33)
  Top 0.203: IC4.7 97,32.7 98.74,30.96 98.74,24.92 97.63,23.81 97.63,18.1 95.73,16.19 92.71,16.19 v92.08,16.83
  Top 0.305: v87.79,14.45 87.79,13.34 89.53,11.59 90.16,11.59 T9.1
  Bottom 0.305: v87.79,14.45 88.9,15.56 89.38,15.56 89.78,15.96 T8.1 90.18,15.88 90.65,15.88 91.6,16.83 v92.08,16.83
N$18
  Top 0.203: 96.84,14.5 96.84,16.67 98.11,17.94 98.11,23.65 99.22,24.77 99.22,31.27 97.79,32.7 97.79,36.04 97.47,36.35 96.2,36.35 95.73,35.88 IC4.6 | 96.78,12.6 R36.2
  Top 0.254: 96.84,14.5 R36.2
  Top 0.305: 96.78,12.6 C27.2 R39.1
N$19  (via drill 0.33)
  Top 0.254: v16.51,18.73 16.03,19.21 16.03,21.43 15.72,21.75 14.61,21.75 v13.97,22.38
  Bottom 0.254: IC1.9 15.5,21.59 14.76,21.59 v13.97,22.38 | 18.94,12.01 R30.2 | R28.2 19.21,16.14 19.21,16.35 19.84,16.99 19.84,18.41 19.53,18.73 v16.51,18.73
  Bottom 0.406: T3.3 18.71,12.61 R30.2 R27.2 R28.2
N$20
  Bottom 0.406: T3.2 T3.4 10.32,14.53 10.32,13.65 9.84,13.65 9.84,10.95 9.05,10.16 X2.1
N$21
  Bottom 0.203: R26.1 20.74,17.8 20.54,18 20.86,18 20.95,18.1
  Bottom 0.254: IC1.8 16.51,20.16 16.67,20 18.41,20 19.21,20.8 22.54,20.8 23.02,20.32 23.02,19.53 22.7,19.21 22.07,19.21 20.95,18.1 20.95,17.73 20.74,17.52
N$22
  Bottom 0.406: X4.1 90.09,4.68 91.12,5.71 93.66,5.71 97.31,9.37 97.31,12.22 96.68,12.86 96.68,20 96.04,20.64 96.04,26.83 95.41,27.46 95.04,27.46 R40.2
N$23
  Bottom 0.305: 95.14,20.59 R41.2
  Bottom 0.406: 95.14,20.59 96.04,19.68 96.04,12.54 96.68,11.91 96.68,9.68 93.34,6.35 86.2,6.35 85.09,5.24 X4.2
N$24
  Bottom 0.406: X4.3 82.97,6.99 93.03,6.99 96.04,10 96.04,11.59 95.14,12.49 R42.2
N$25  (via drill 0.33)
  Top 0.254: R6.2 14.55,26.62 14.76,26.83 15.93,26.83 R16.2 16.25,26.93 16.99,26.19 21.75,26.19 v22.54,26.99
  Bottom 0.254: IC1.1 21.59,27.78 | 21.59,27.78 21.59,26.51 IC1.2 | 21.59,27.78 22.54,27.78 | 22.54,27.78 22.91,27.78 R20.2 | v22.54,26.99 22.54,27.78
N$26  (via drill 0.33)
  Top 0.254: C10.1 17.97,27.59 17.62,27.94 v14.13,27.94
  Bottom 0.203: C33.1 8.03,29.28 10.32,26.99 11.91,26.99 12.54,27.62 12.75,27.62 R18.1
  Bottom 0.254: 13.12,27.78 arc-90 R18.1 arc-90 13.07,27.94 v14.13,27.94 14.29,27.78 IC1.14
N$27  (via drill 0.33)
  Top 0.254: R16.1 15.93,25.24 v14.13,25.24 13.65,25.72 13.65,27.3 13.34,27.62 11.91,27.62 11.27,26.99 11.14,26.99 C3.1
  Bottom 0.254: IC1.12 v14.13,25.24
N$28  (via drill 0.33)
  Top 0.254: D1.3 16.18,22.7 v17.3,22.7
  Bottom 0.254: C13.2 13.62,21.43 13.65,21.43 13.65,20.95 13.49,20.8 16.99,20.8 18.1,21.91 | IC1.10 v17.3,22.7 18.1,21.91 | R22.1 36.62,36.99 36.35,36.99 36.35,33.34 33.02,30 26.19,30 24.13,27.94 24.13,25.4 23.65,24.92 23.65,23.18 22.54,22.07 19.37,22.07 19.21,21.91 18.1,21.91
N$29  (via drill 0.33)
  Top 0.254: R19.1 20.37,21.27 20.53,21.43 v23.18,21.43 23.34,21.59 23.34,32.38 21.91,33.81 19.68,33.81 18.89,34.61 17.84,34.61 VR3.CCW
  Bottom 0.254: 21.02,21.27 IC1.6 v23.18,21.43
N$30  (via drill 0.33)
  Top 0.254: VR3.SLIDER 18.57,38.89 19.84,37.62 19.84,34.61 20.16,34.29 22.23,34.29 23.81,32.7 23.81,20.95 22.86,20 v22.38,20
  Bottom 0.254: VR3.SLIDER VR3.CW | C13.1 10.79,20.19 10.79,20.16 11.43,19.53 18.73,19.53 19.37,20.16 IC1.7 21.75,20.16 21.91,20 v22.38,20
N$31
  Bottom 0.254: 23.97,31.27 23.71,31.27 R21.2 23.76,30.8 25.24,30.8 25.56,30.48 32.7,30.48 35.88,33.66 35.88,39.69 38.42,42.23 39.75,42.23 VR4.CW
N$32
  Bottom 0.254: R9.2 83.13,40.01 83.34,40.01 84.45,38.89 VR2.SLIDER
N$33  (via drill 0.33)
  Top 0.254: C10.2 18.26,23.18 v18.73,22.7
  Bottom 0.254: v18.73,22.7 IC1.5 22.38,22.7 23.02,23.34 R20.1
N$35
  Bottom 0.254: R22.2 36.94,38.89 VR4.SLIDER
N$39
  Bottom 0.254: R7.1 SL1.2
N$42
  Bottom 0.254: R8.2 59.9,41.22 62.23,38.89 VR1.SLIDER
N$43
  Bottom 0.305: R23.1 JP2.5
N$44
  Top 0.61: IC5.2 IC5.4 43.26,11.27 40.01,11.27 39.05,10.32 C30.+ 38.58,10.58 38.47,10.48 L2.2
N$45  (via drill 0.33)
  Top 0.203: C25.1 R37.2 | 93.34,25.77 93.03,25.77
  Top 0.254: 93.34,25.77 R37.2 93.03,25.77 v93.03,27.3
  Top 0.305: D3.C v93.03,27.3 94.14,28.42 95.57,28.42 95.89,28.73 95.89,30.32 95.64,30.57 91.19,30.57 91.03,30.73 T5.3 | D3.C 93.19,25.92 93.19,25.77 | 93.03,25.77 D3.C
  Bottom 0.254: 92.71,26.99 92.71,25.77
  Bottom 0.305: v93.03,27.3 92.71,26.99 D2.A 92.69,26.11 | T4.3 90.43,25.77 92.71,25.77 R40.1
N$46
  Top 0.61: X1.1 74.61,5.08 73.82,5.87 71.91,5.87 65.41,12.38 60.1,12.38 B1.AC1
N$47
  Top 0.61: B1.AC2 63.67,10.79 64.14,10.32 66.36,10.32 69.53,7.14 X1.2
N$48
  Top 0.254: IC4.13 IC4.14
N$49
  Bottom 0.254: R5.2 SL1.3
N$53
  Bottom 0.305: R24.1 JP2.4
N$56
  Bottom 0.305: R25.1 JP2.3
N$90
  Bottom 0.254: R29.2 68.44,37.75 X3.1 70.22,37.55 C14.1
OSCI
  Bottom 0.254: X3.3 71.75,42.41 71.75,42.55 71.12,43.18 69.06,43.18 68.74,42.86 68.74,40.8 68.58,40.8 68.58,40.59 C17.1 68,40.32 67.79,40.32 67.15,39.69 67.15,35.24 67.51,34.88 IC2.5
OSCO
  Bottom 0.254: IC2.6 68.01,35.52 R29.1
PHASE1  (via drill 0.33)
  Top 0.254: v71.91,22.54 73.66,24.29 73.66,25.88 v74.77,26.99
  Bottom 0.254: IC2.29 69.01,22.43 69.22,22.23 71.6,22.23 v71.91,22.54 | R31.2 89.85,37.73 89.85,37.47 89.22,36.83 89.22,36.04 88.9,35.72 88.9,34.29 87.79,33.18 84.61,33.18 83.82,32.38 83.34,32.38 78.26,27.3 75.09,27.3 v74.77,26.99
PHASE2  (via drill 0.33)
  Top 0.254: v71.91,21.59 71.6,21.59 71.28,21.91 71.28,22.86 73.18,24.77 73.18,26.83 v73.82,27.46
  Bottom 0.254: IC2.30 68.51,22.29 69.06,21.75 71.75,21.75 v71.91,21.59 | R32.2 89.85,39.48 89.85,39.21 89.22,38.58 89.22,37.62 88.74,37.15 88.74,36.2 88.42,35.88 88.42,34.45 87.63,33.66 84.45,33.66 83.66,32.86 83.19,32.86 78.11,27.78 74.14,27.78 v73.82,27.46
PHASE3  (via drill 0.33)
  Top 0.254: v71.91,20.64 72.07,20.64 72.55,21.11 72.55,22.38 74.14,23.97 74.14,24.92 v75.72,26.51
  Bottom 0.254: IC2.31 68.01,22.16 68.9,21.27 71.28,21.27 v71.91,20.64 | R33.2 89.38,35.51 89.38,34.13 87.95,32.7 84.77,32.7 83.98,31.91 83.5,31.91 78.42,26.83 76.04,26.83 v75.72,26.51
POT1  (via drill 0.33)
  Top 0.254: v66.83,34.61 v68.9,34.61
  Bottom 0.254: R8.1 C5.1 59.88,37.75 60.64,36.99 66.36,36.99 66.67,36.67 66.67,34.77 v66.83,34.61 | v68.9,34.61 70.01,33.5 IC2.10
POT2  (via drill 0.33)
  Top 0.254: v78.58,34.61 81.76,34.61 v82.71,35.56
  Bottom 0.254: R9.1 82.87,37.12 C6.1 v82.71,35.56 | IC2.11 70.51,32.41 70.8,32.7 71.75,32.7 73.66,34.61 v78.58,34.61
RESET  (via drill 0.33)
  Top 0.254: v65.88,20.95 65.72,21.11 65.72,23.18 66.04,23.5 66.04,30.8 67.31,32.07 67.94,32.07 v68.9,33.02
  Bottom 0.254: IC2.7 68.51,32.63 v68.9,33.02 | 29.69,6.35 29.48,6.35 | 29.48,6.35 C12.1 | 29.48,6.35 29.37,6.35 29.37,6.67 29.53,6.67 35.24,12.38 58.1,12.38 64.45,18.73 64.45,20.16 65.25,20.95 v65.88,20.95
  Bottom 0.305: C12.1 R25.2
SW1
  Bottom 0.254: SW1.A SW1.A' 34.45,24.13 56.67,24.13 59.36,26.81 IC2.41 | 27.66,22.37 SW1.A | SW1.A 27.66,21.15 27.62,21.11 C2.1 R2.2
SW2
  Top 0.254: SW2.A SW2.A'
  Bottom 0.254: 50.52,22.37 SW2.A 50.48,22.3 C8.1 R13.2 | IC2.40 59.49,26.31 SW2.A'
SW3
  Bottom 0.254: 74.65,22.42 SW3.A | SW3.A 74.61,22.3 C4.1 R1.2 | IC2.20 73.62,26.71 74.65,25.68 SW3.A | SW3.A' SW3.A
SWCLK  (via drill 0.33)
  Top 0.254: v63.98,20.8 64.14,20.95 64.14,22.86 v63.98,23.02
  Bottom 0.254: R24.2 25.03,6.62 25.88,7.46 29.53,7.46 34.92,12.86 57.78,12.86 63.82,18.89 63.82,20.64 v63.98,20.8 | v63.98,23.02 63.98,24.81 IC2.37
SWDIO
  Bottom 0.254: R23.2 22.33,6.62 23.65,7.94 29.21,7.94 34.61,13.34 57.47,13.34 63.18,19.05 63.18,21.11 63.66,21.59 65.88,21.59 66.52,22.23 IC2.34
VDDA  (via drill 0.33)
  Top 0.254: v70.33,30.32 C31.1 71.23,28.95 71.28,28.89 71.25,28.89 C32.1 70.17,27.81 70.17,27.62 69.43,26.88 L1.1
  Bottom 0.254: IC2.9 69.51,30.82 70.01,30.32 v70.33,30.32
VIN
  Top 0.61: C16.1 55.53,9.81 C15.+ 58.1,7.62 58.1,2.38 58.57,1.92 B1.+
  Bottom 0.61: IC3.1 41.27,3.97 41.91,4.6 52.55,4.6 55.72,7.78 C15.+

### Text on the board
Top: StrobeTuner
Document: LCD 5510 | MIC | LED | DEBUG | PROGRAM | 7812 | AC 11V | MOTOR
_tsilk: 1 | StrobeTuner | M. Kobuszewski | LCD | GAIN | BRIGHTNESS\ | PITCH | OFFSET | HOT | MIC | A | DOWN | SELECT | UP | LED | K | 11VAC | BLDC MOTOR | DBG | DIO | CLK | RST | 3V3 | GND